# EAGLE design bloom (EAGLE 7.7.0)
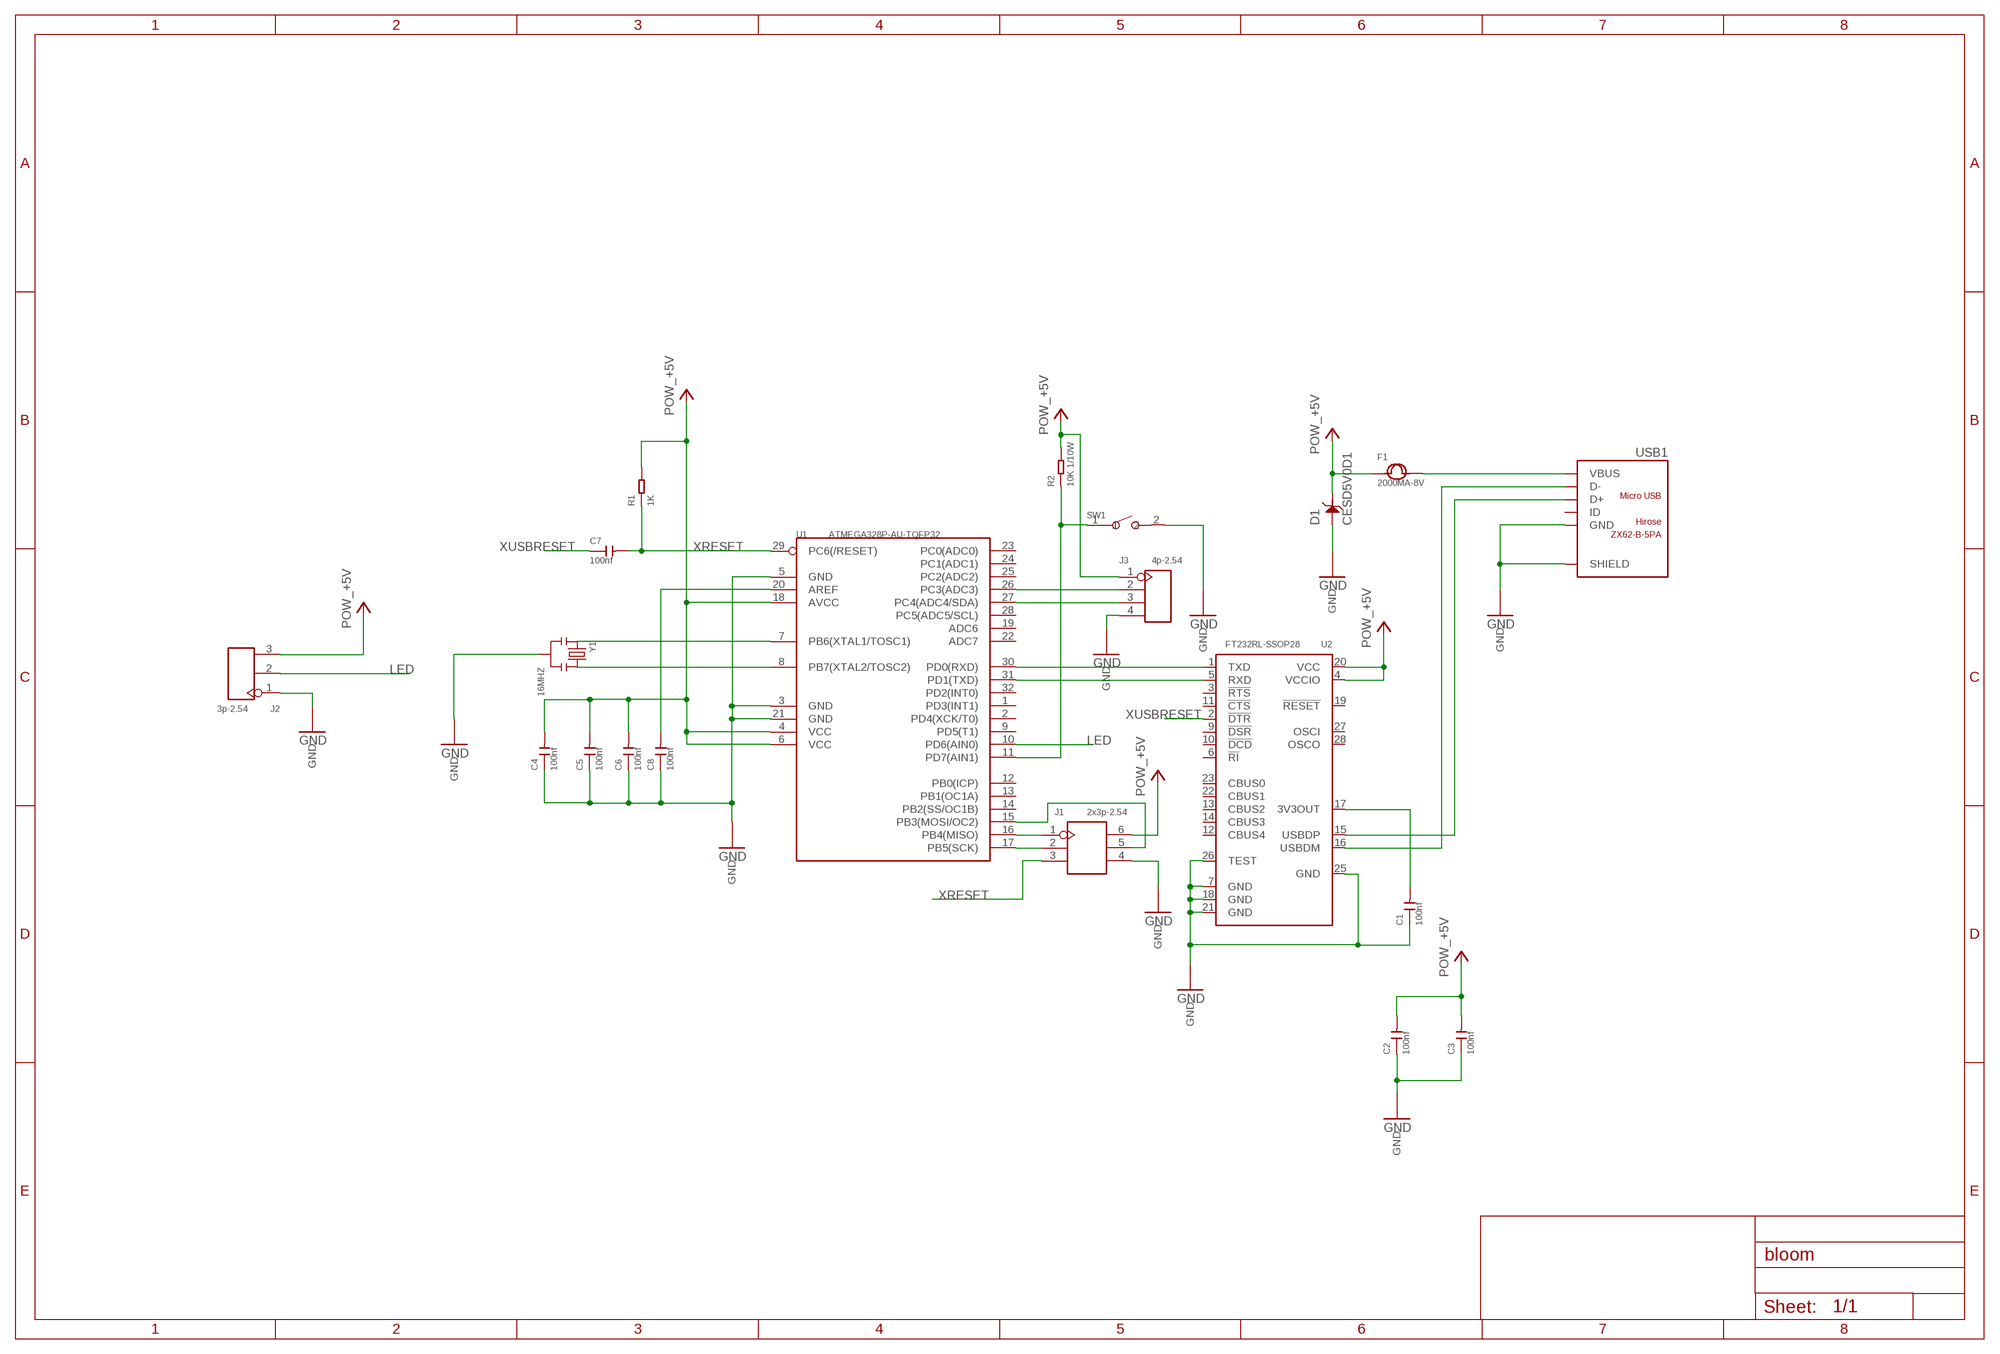
[diagram p0: schematic, sheet 1]

## Parts
C1  100nf  CERAMIC-100NF-25V-10%-X7R(0402)  [C0402]
C2  100nf  CERAMIC-100NF-25V-10%-X7R(0402)  [C0402]
C3  100nf  CERAMIC-100NF-25V-10%-X7R(0402)  [C0402]
C4  100nf  CERAMIC-100NF-25V-10%-X7R(0402)  [C0402]
C5  100nf  CERAMIC-100NF-25V-10%-X7R(0402)  [C0402]
C6  100nf  CERAMIC-100NF-25V-10%-X7R(0402)  [C0402]
C7  100nf  CERAMIC-100NF-25V-10%-X7R(0402)  [C0402]
C8  100nf  CERAMIC-100NF-25V-10%-X7R(0402)  [C0402]
D1  CESD5V0D1  SMD-DIODE-ESD-6.2V-250MW(SOD-123)  [SOD-123]
F1  2000MA-8V  SMD-PPTC-750MA-6V(1210)  [F1210]
J1  2x3p-2.54  DIP-BLACK-FEMALE-HEADER-VERT(2X3P-2.54)  [H2X3-2.54]
J2  3p-2.54  DIP-BLACK-FEMALE-HEADER-VERT(3P-2.54)  [H3-2.54]
J3  4p-2.54  DIP-BLACK-FEMALE-HEADER-VERT(4P-2.54)  [H4-2.54]
R1  1K  SMD-RES-1K-1%-1/10W(0603)  [R0603]
R2  10K 1/10W  SMD-RES-10K-5%-1/10W(0603)  [R0603]
SW1  SMD-BUTTON(2P-3.0X2.5X1.2+0.4MM)-B3U-1000P-2P-SMD  [SW2-2.6-3.0X2.5X1.2+0.4MM]
U1  ATMEGA328P-AU-TQFP32  MCU-ATMEGA328P-AU(TQFP32)  [TQFP32-0.8-7X7MM]
U2  FT232RL-SSOP28  INTERFACE-FT232RL(SSOP28)  [SSOP28-0.65-10.2X5.2MM]
USB1  ZX62-B-5PA  MICRO-USB-SMD(ZX62-B-5PA)  [MICRO-USB5+6P-SMD-0.65-AB]
Y1  16MHZ  SMD-RESONATOR-16MHZ-15PF-0.5%-40R(3P-3.2X1.3MM)  [X3-SMD-3.6X1.3X0.8MM]

## Nets
+5V: C2.2 C3.2 C4.2 C5.2 C6.2 D1.- F1.1 J1.6 J2.3 J3.1 R1.2 R2.2 U1.4(VCC) U1.6(VCC) U1.18(AVCC) U2.4(VCCIO) U2.20(VCC) ; supply symbol labelled POW_+5V
GND: C1.1 C2.1 C3.1 C4.1 C5.1 C6.1 C8.1 D1.+ J1.4 J2.1 J3.4 SW1.2 U1.3(GND) U1.5(GND) U1.21(GND) U2.7(GND) U2.18(GND) U2.21(GND) U2.25(GND) U2.26(TEST) USB1.5(GND) USB1.P1(SHIELD) USB1.P2(SHIELD) USB1.P3(SHIELD) USB1.P4(SHIELD) USB1.P5(SHIELD) USB1.P6(SHIELD) Y1.2
LED: J2.2 U1.10(PD6(AIN0))
N$1: C8.2 U1.20(AREF)
N$2: U1.30(PD0(RXD)) U2.1(TXD)
N$3: U1.7(PB6(XTAL1/TOSC1)) Y1.1
N$4: U1.31(PD1(TXD)) U2.5(RXD)
N$5: U2.15(USBDP) USB1.3(D+)
N$6: U2.16(USBDM) USB1.2(D-)
N$7: U1.8(PB7(XTAL2/TOSC2)) Y1.3
N$8: J1.1 U1.16(PB4(MISO))
N$9: J1.2 U1.17(PB5(SCK))
N$10: J1.5 U1.15(PB3(MOSI/OC2))
N$11: R2.1 SW1.1 U1.11(PD7(AIN1))
N$13: C1.2 U2.17(3V3OUT)
N$14: J3.2 U1.26(PC3(ADC3))
N$15: J3.3 U1.27(PC4(ADC4/SDA))
VBUS: F1.2 USB1.1(VBUS)
XRESET: C7.2 J1.3 R1.1 U1.29(PC6(/RESET))
XUSBRESET: C7.1 U2.2(!DTR)
Unconnected: U1.1(PD3(INT1)) U1.2(PD4(XCK/T0)) U1.9(PD5(T1)) U1.12(PB0(ICP)) U1.13(PB1(OC1A)) U1.14(PB2(SS/OC1B)) U1.19(ADC6) U1.22(ADC7) U1.23(PC0(ADC0)) U1.24(PC1(ADC1)) U1.25(PC2(ADC2)) U1.28(PC5(ADC5/SCL)) U1.32(PD2(INT0)) U2.3(!RTS) U2.6(!RI) U2.9(!DSR) U2.10(!DCD) U2.11(!CTS) U2.12(CBUS4) U2.13(CBUS2) U2.14(CBUS3) U2.19(!RESET) U2.22(CBUS1) U2.23(CBUS0) U2.27(OSCI) U2.28(OSCO) USB1.4(ID)

## Library data of the parts
C1-C8 = Seeed-OPL-Capacitor:CERAMIC-100NF-25V-10%-X7R(0402): 302010024; MPN: CC0402KRX7R8BB104
D1 = Seeed-OPL-Diode:SMD-DIODE-ESD-6.2V-250MW(SOD-123): 304060001; MPN: CESD5V0D1
F1 = Seeed-OPL-fuse:SMD-PPTC-750MA-6V(1210): 307010010; MPN: SMD1210R075SF; VALUE: 750MA-6V
J1 = Seeed-OPL-Connector:DIP-BLACK-FEMALE-HEADER-VERT(2X3P-2.54): 320030011; MPN: F185-1203A1BSYA1
J2 = Seeed-OPL-Connector:DIP-BLACK-FEMALE-HEADER-VERT(3P-2.54): 320030024; MPN: F185-1103A0BSYA1
J3 = Seeed-OPL-Connector:DIP-BLACK-FEMALE-HEADER-VERT(4P-2.54): 320030017; MPN: F185-1104A1BSYA1
R1 = Seeed-OPL-Resistor:SMD-RES-1K-1%-1/10W(0603): 301010298; MPN: RC0603FR-071KL
R2 = Seeed-OPL-Resistor:SMD-RES-10K-5%-1/10W(0603): 301010293; MPN: RC0603JR-0710KL
SW1 = Seeed-OPL-Switch:SMD-BUTTON(2P-3.0X2.5X1.2+0.4MM): 311020047
U1 = Seeed-OPL-ic:MCU-ATMEGA328P-AU(TQFP32): 310010049; MPN: ATMEGA328P-AU
U2 = Seeed-OPL-ic:INTERFACE-FT232RL(SSOP28): 310070022; MPN: FT232RL
USB1 = Seeed-OPL-Connector:MICRO-USB-SMD(ZX62-B-5PA): 320010005; MPN: ZX62-B-5PA
Y1 = Seeed-OPL-Crystal-Oscillator:SMD-RESONATOR-16MHZ-15PF-0.5%-40R(3P-3.2X1.3MM): 306030002; MPN: CSTCE16M0V53-R0

## Board
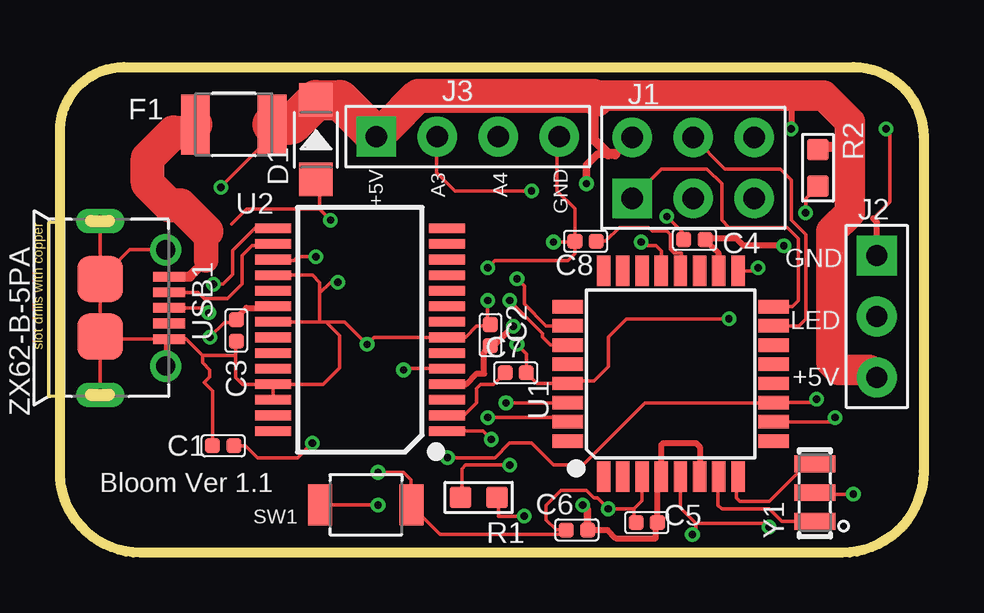
[diagram p1: board, top side]
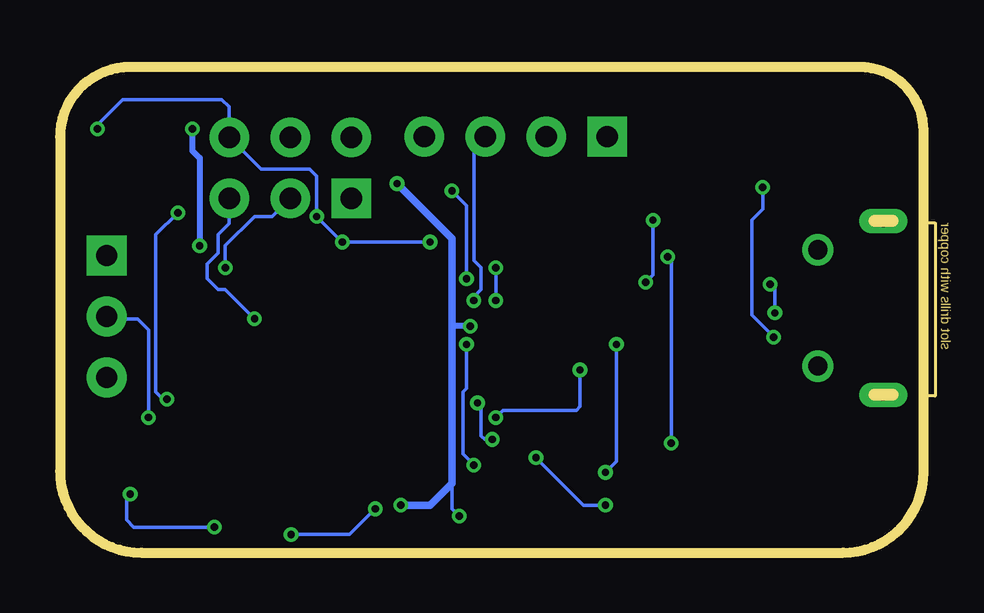
[diagram p2: board, bottom side, seen from below]

Size 36 x 20.25 mm. Coordinates in mm from the lower left corner, seen from the top.
Outline: 36,17.34 36,3.4 arc-90 32.6,0 3.36,0 arc-90 0,3.36 0,17.59 arc-90 2.66,20.25 33.09,20.25 arc-90 36,17.34
Copper layers (1*16): Top 0.035mm / dielectric 1.5mm / Bottom 0.035mm
Design rules "Elecrow_2-layer_eagle_rule": minimum track width 6mil, minimum drill 12mil, track to track 6mil, track to pad 6mil, pad to pad 6mil, via to via 6mil, smd to smd 0mil, copper to edge 10mil, drill to drill 10mil, minimum pad ring 10mil, minimum via ring 6mil, stop-mask expansion 2mil, vias tented up to drill 100mil, thermal gap 10mil

### Footprints (pad centres in the part's own frame; a part is rotated, then mirrored left to right if it is on the bottom)
C0402 = smd 0.635 x 0.635: 1 0,0.445; 2 0,-0.445
SOD-123 = smd 1.397 x 1.397: + -1.651,0; - 1.651,0
F1210 = smd 1.2 x 2.5: 1 -1.6,0; 2 1.6,0
H2X3-2.54 = drill 0.889 pad 1.651 square: 1 -1.27,2.54 | drill 0.889 pad 1.651: 2 -1.27,0; 3 -1.27,-2.54; 4 1.27,-2.54; 5 1.27,0; 6 1.27,2.54
H3-2.54 = drill 0.889 pad 1.651 square: 1 0,2.54 | drill 0.889 pad 1.651: 2 0,0; 3 0,-2.54
H4-2.54 = drill 0.889 pad 1.651 square: 1 0,3.81 | drill 0.889 pad 1.651: 2 0,1.27; 3 0,-1.27; 4 0,-3.81
R0603 = smd 0.889 x 0.889: 1 0,0.762; 2 0,-0.762
SW2-2.6-3.0X2.5X1.2+0.4MM = smd 1 x 1.7: 1 -1.9,0; 2 1.9,0
TQFP32-0.8-7X7MM = smd 1.27 x 0.559: 1 -4.293,2.8; 2 -4.293,2; 3 -4.293,1.2; 4 -4.293,0.4; 5 -4.293,-0.4; 6 -4.293,-1.2; 7 -4.293,-2; 8 -4.293,-2.8; 17 4.293,-2.8; 18 4.293,-2; 19 4.293,-1.2; 20 4.293,-0.4; 21 4.293,0.4; 22 4.293,1.2; 23 4.293,2; 24 4.293,2.8 | smd 0.559 x 1.27: 9 -2.8,-4.293; 10 -2,-4.293; 11 -1.2,-4.293; 12 -0.4,-4.293; 13 0.4,-4.293; 14 1.2,-4.293; 15 2,-4.293; 16 2.8,-4.293; 25 2.8,4.293; 26 2,4.293; 27 1.2,4.293; 28 0.4,4.293; 29 -0.4,4.293; 30 -1.2,4.293; 31 -2,4.293; 32 -2.8,4.293
SSOP28-0.65-10.2X5.2MM = smd 0.4 x 1.5: 1 -4.225,-3.625; 2 -3.575,-3.625; 3 -2.925,-3.625; 4 -2.275,-3.625; 5 -1.625,-3.625; 6 -0.975,-3.625; 7 -0.325,-3.625; 8 0.325,-3.625; 9 0.975,-3.625; 10 1.625,-3.625; 11 2.275,-3.625; 12 2.925,-3.625; 13 3.575,-3.625; 14 4.225,-3.625; 15 4.225,3.625; 16 3.575,3.625; 17 2.925,3.625; 18 2.275,3.625; 19 1.625,3.625; 20 0.975,3.625; 21 0.325,3.625; 22 -0.325,3.625; 23 -0.975,3.625; 24 -1.625,3.625; 25 -2.275,3.625; 26 -2.925,3.625; 27 -3.575,3.625; 28 -4.225,3.625
MICRO-USB5+6P-SMD-0.65-AB = smd 0.4 x 1.35: 1 -1.3,2.875; 2 -0.65,2.875; 3 0,2.875; 4 0.65,2.875; 5 1.3,2.875 | smd 1.9 x 1.9: P1 -1.2,0; P2 1.2,0 | drill 0.508 pad 1.016 long: P3 -3.625,0; P4 3.625,0 | drill 0.8: P5 -2.425,2.73; P6 2.425,2.73
X3-SMD-3.6X1.3X0.8MM = smd 0.7 x 1.7: 1 -1.2,0; 2 0,0; 3 1.2,0

### Placement (x,y rotation side)
C1  6.8,4.46 90 top
C2  17.95,9.07 0 top
C3  7.35,9.26 180 top
C4  26.45,13.06 90 top
C5  24.46,1.25 90 top
C6  21.55,0.95 90 top
C7  19,7.5 90 top
C8  21.91,12.99 90 top
D1  10.67,17.22 90 top
F1  7.25,17.86 180 top
J1  26.4,16.05 90 top
J2  34.05,9.85 0 top
J3  17,17.35 90 top
R1  17.45,2.3 90 top
R2  31.6,16.05 180 top
SW1  12.75,2 0 top
U1  25.46,7.46 90 top
U2  12.5,9.3 90 top
USB1  1.68,10.21 270 top
Y1  31.47,2.5 90 top

### Tracks (layer width: path | path; a pad name or v marks a point on that pad's centre or on a via)
+5V  (via drill 0.3)
  Top 0.152: v19.36,1.52 18.29,1.52 18.29,2.22 R1.2 | F1.1 8.85,17.38 v6.71,15.24 | v6.25,8.99 6.86,9.6 7.24,9.6 C3.2
  Top 0.254: C3.2 7.35,9.79 7.77,10.21 8.81,10.21 U2.20 | U1.6 26.67,3.17 26.67,4.42 26.52,4.57 25.15,4.57 25.06,4.49 U1.4 24.9,3.01 C5.2 24.84,1.19 24.84,0.61 23.16,0.61 22.82,0.95 C6.2 | U1.18 27.46,12.49 C4.2 | U2.4 16.93,7.03 17.37,7.47 17.68,7.47 17.68,8.36 C2.2 | 17.98,8.59 C2.2 | C2.2 18.08,8.63 v18.9,9.45 | C4.2 26.93,13.06 26.98,13.11 | 32.16,13.41 32.16,14.02 32.92,14.78 32.92,17.68 31.7,18.9 30.48,18.9 v30.48,17.68 | v30.18,12.8 28.5,12.8 28.19,13.11 26.94,13.11 C4.2
  Top 0.305: C6.2 21.99,1.78 v21.79,1.98 | v21.95,15.39 21.95,16.15 22.4,16.61 23.15,16.61 J1.6
  Top 0.406: 23.15,16.61 22.86,16.61 22.25,17.22 22.25,18.75 22.4,18.9 22.55,19.05 | 32.16,13.41 32.16,13.56 33.22,14.63 33.22,16.61 32.92,16.92 31.7,16.92 R2.2
  Top 1.27: 13.01,17.53 J3.1 13.19,17.76 13.65,17.76 | 22.55,19.05 31.85,19.05 32.92,17.98 32.92,16.92 32.92,14.78 32.92,14.17 32.16,13.41 32.16,7.92 32.46,7.62 33.74,7.62 J2.3
  Top 1.422: 22.4,18.9 22.25,19.05 14.94,19.05 13.65,17.76
  Top 1.676: F1.1 9.65,17.86 D1.- 11.67,18.87 J3.1
  Bottom 0.152: 19.66,2.9 19.66,1.83 v19.36,1.52 | v6.71,15.24 6.71,14.33 7.16,13.87 7.16,9.91 v6.25,8.99
  Bottom 0.254: v18.9,9.45 19.66,9.45 | v30.48,17.68 30.48,16.76 30.18,16.46 v30.18,12.8
  Bottom 0.305: v21.79,1.98 20.57,1.98 19.66,2.9 19.66,9.45 19.66,13.11 v21.95,15.39
GND  (via drill 0.3)
  Top 0.152: U1.3 24.26,2.17 23.93,1.83 | 23.93,1.83 23.93,1.34 C5.1 | v13.26,3.35 14.33,3.35 14.63,3.05 14.63,2.02 SW1.2 14.65,1.96 15.85,0.76 20.92,0.76 C6.1 20.69,0.95 20.27,1.37 20.27,1.98 20.88,2.59 21.95,2.59 22.25,2.29 22.4,2.29 v22.86,1.83 23.93,1.83 | 26.52,1.22 29.41,1.22 v29.57,1.07 | v33.07,2.44 31.53,2.44 Y1.2 | U1.5 25.86,1.87 26.52,1.22 | 26.52,1.22 26.52,0.91 v26.36,0.76 | 33.9,13.94 34.59,14.63 34.59,17.53 v34.44,17.68 | C4.1 26,13.31 v25.3,14.02 | U1.21 25.06,12.58 24.84,12.8 24.38,12.8 v24.23,12.95 | v20.57,12.95 21.44,12.95 C8.1 | C8.1 21.47,14.34 20.73,15.09 20.73,17.27 J3.4 | C8.1 21.47,12.48 21.18,12.19 18.14,12.19 v17.83,11.89 | v17.83,10.52 17.83,9.63 C2.1 17.88,9.45 17.37,9.45 16.9,8.97 U2.7 13.09,8.97 v12.8,8.69 11.86,9.62 10.82,9.62 | 10.82,9.62 U2.21 11.1,9.62 11.66,9.07 11.66,7.7 10.97,7.01 8.89,7.01 U2.25 | U2.18 10.52,11.57 10.82,11.28 10.82,10.82 | 10.82,10.82 10.82,9.62 | U2.25 7.61,7.03 7.32,7.32 7.32,8.23 | 7.32,8.23 7.32,8.79 C3.1 | 5.94,8.23 5.26,8.91 USB1.5 | 5.94,8.23 7.32,8.23 | 5.94,8.23 5.94,7.92 6.25,7.62 6.25,7.34 6.01,7.1 6.36,6.75 C1.1 | 7.16,13.71 7.77,14.33 10.82,14.33 | 10.82,14.33 v11.28,13.87 | v11.58,11.28 11.28,11.28 10.82,10.82 | 10.82,14.33 10.82,15.38 | U2.26 U2.25 | USB1.5 1.78,8.91 USB1.P2 | USB1.P2 USB1.P4 | USB1.P6 4.41,8.77 USB1.5 | USB1.P1 USB1.P2 | USB1.P1 USB1.P3 | USB1.P5 2.9,12.64 USB1.P1
  Top 0.254: J2.1 34.05,13.78 33.9,13.94 | D1.+ 10.67,15.53 10.82,15.38
  Bottom 0.152: v12.8,8.69 12.8,3.81 v13.26,3.35 | v29.57,1.07 32.92,1.07 33.22,1.37 33.22,2.29 v33.07,2.44 | v26.36,0.76 23.93,0.76 v22.86,1.83 | v34.44,17.68 34.44,17.83 33.38,18.9 29.26,18.9 28.96,18.59 28.96,17.34 J1.4 27.62,16 25.6,16 25.3,15.7 v25.3,14.02 v24.23,12.95 v20.57,12.95 | v17.83,11.89 v17.83,10.52 | v11.28,13.87 11.28,11.58 v11.58,11.28
LED  (via drill 0.3)
  Top 0.152: U1.10 32.13,5.46 v32.31,5.64
  Bottom 0.152: v32.31,5.64 32.31,9.3 32.77,9.75 33.8,9.75 J2.2
N$1
  Top 0.152: C8.2 22.74,12.99 23.32,13.56 24.54,13.56 24.69,13.41 25.3,13.41 25.45,13.26 25.45,12.65 25.6,12.5 25.91,12.5 25.91,11.79 U1.20
N$2  (via drill 0.3)
  Top 0.152: U2.1 17.63,5.08 v17.98,4.72 | v18.59,6.25 21.16,6.25 U1.30
  Bottom 0.152: v17.98,4.72 18.29,4.72 18.44,4.88 18.44,6.1 v18.59,6.25
N$3
  Top 0.152: Y1.1 30.09,1.3 29.57,1.83 27.58,1.83 27.43,1.98 27.43,3.13 U1.7
N$4  (via drill 0.3)
  Top 0.152: U2.5 14.38,7.67 v14.33,7.62 | v17.83,5.64 20.99,5.64 U1.31
  Bottom 0.152: v14.33,7.62 14.33,6.1 14.48,5.94 17.53,5.94 v17.83,5.64
N$5  (via drill 0.3)
  Top 0.152: v6.4,11.2 6.8,11.2 7.2,11.6 7.2,12.6 8.2,13.6 8.8,13.6 U2.15 | USB1.3 5.99,10.21 v6.2,10
  Bottom 0.152: v6.2,10 6.2,11 v6.4,11.2
N$6
  Top 0.152: U2.16 8.8,12.8 8,12.8 7.6,12.4 7.6,11.2 6.99,10.59 6.02,10.59 5.75,10.86 USB1.2
N$7
  Top 0.152: Y1.3 31.14,3.7 29.57,2.13 28.35,2.13 28.19,2.29 28.19,3.1 U1.8
N$8
  Top 0.152: U1.16 30.53,10.26 30.79,10.52 30.79,13.11 30.33,13.56 27.89,13.56 27.58,13.87 27.58,15.39 26.98,16 25.08,16 J1.1
N$9  (via drill 0.3)
  Top 0.152: U1.17 28.97,11.75 v29.11,11.89
  Bottom 0.152: v29.11,11.89 29.11,12.8 27.89,14.02 27.16,14.02 J1.2
N$10
  Top 0.152: U1.15 30.79,9.46 31.09,9.75 31.09,13.26 30.48,13.87 30.48,15.54 30.02,16 27.72,16 J1.5
N$11  (via drill 0.3)
  Top 0.152: v31.55,6.4 31.4,6.26 U1.11 29.75,6.25 24.38,6.25 21.79,3.66 20.57,3.66 19.66,4.57 18.75,4.57 18.14,3.96 v16.15,3.96 | v31.09,14.17 31.09,14.78 R2.1 | SW1.1 13.24,2 v13.26,1.98
  Bottom 0.152: v31.55,6.4 31.7,6.4 32,6.71 32,13.26 v31.09,14.17 | v13.26,1.98 14.17,1.98 v16.15,3.96
N$13  (via drill 0.3)
  Top 0.152: C1.2 7.73,4.46 8.23,3.96 9.91,3.96 v10.52,4.57 | v10.67,12.34 9.91,12.34 9.75,12.19 8.91,12.19 U2.17
  Bottom 0.152: v10.52,4.57 10.52,12.19 v10.67,12.34
N$14  (via drill 0.3)
  Top 0.152: U1.26 20.26,9.46 19.36,10.36 19.36,11.12 v19.05,11.43 | v19.66,15.09 16.46,15.09 15.7,15.85 15.7,17.32 J3.2
  Bottom 0.152: v19.05,11.43 19.05,14.48 v19.66,15.09
N$15  (via drill 0.3)
  Top 0.152: U1.27 20.45,8.66 20.12,8.99 20.12,9.14 v18.75,10.52
  Bottom 0.152: J3.3 18.75,16.88 18.75,12.19 18.44,11.89 18.44,10.97 18.75,10.67 v18.75,10.52
VBUS
  Top 0.406: F1.2 5.79,17.4 5.79,17.3 | USB1.1 5.42,11.51 6.1,12.19
  Top 1.016: 5.67,17.53 F1.2 | 6.1,12.19 6.1,13.41 | 5.03,14.48 4.42,14.48
  Top 1.422: F1.2 5.32,17.53 4.72,17.53 3.66,16.46 3.66,15.39 4.57,14.48 5.03,14.48 6.1,13.41
XRESET  (via drill 0.3)
  Top 0.152: v19.05,8.69 19.45,8.29 C7.2 19.89,7.06 U1.29 21.28,7.16 22.25,7.16 22.86,7.77 22.86,8.99 23.62,9.75 v27.89,9.75 | v18.75,3.66 16.92,3.66 16.76,3.5 16.76,2.38 R1.1
  Bottom 0.152: v19.05,8.69 19.05,6.86 19.2,6.71 19.2,4.12 v18.75,3.66 | J1.3 28.94,13.73 29.41,13.26 29.41,12.5 29.87,12.04 29.87,11.43 29.41,10.97 29.11,10.97 v27.89,9.75
XUSBRESET
  Top 0.152: U2.2 16.85,5.72 17.37,6.25 17.37,6.86 17.53,7.01 18.07,7.01 C7.1

### Text on the board
tNames: A3 | A4 | +5V | GND | GND | LED | +5V | Bloom Ver 1.1